# Altium schematic sheet PSFB_low_voltage_supply.SchDoc
size 420 x 297 mm
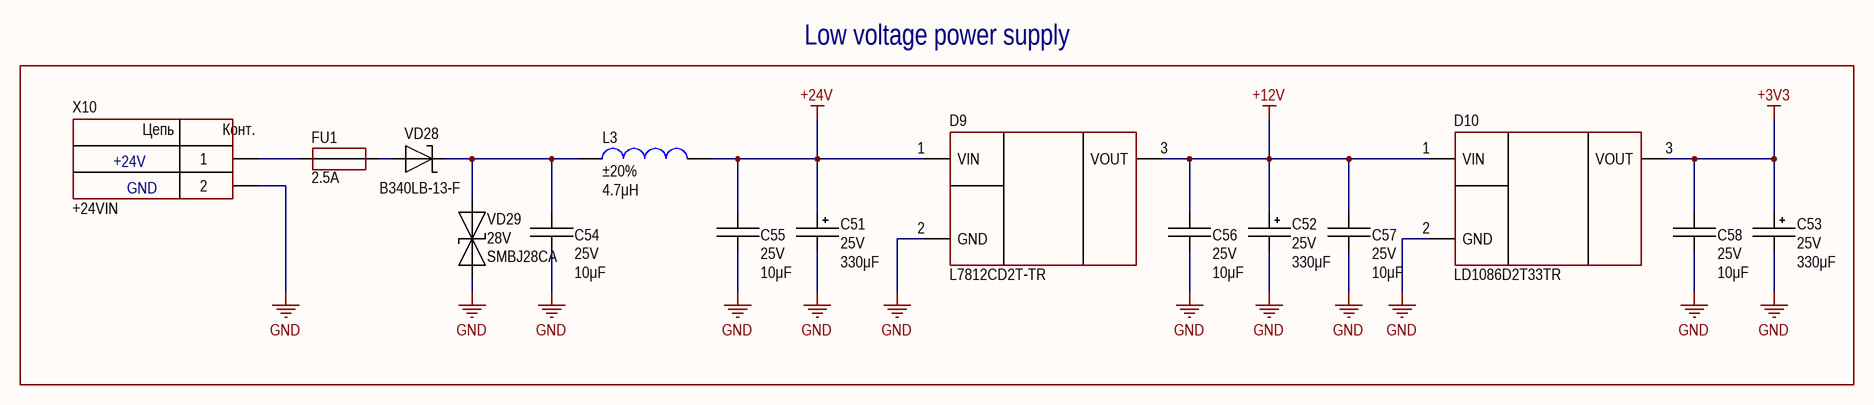
[diagram p0: PSFB_low_voltage_supply.SchDoc]

## Parts
C51  value 330μF  Voltage: 25V  [CAP: D8C3.5H12]
C52  value 330μF  Voltage: 25V  [CAP: D8C3.5H12]
C53  value 330μF  Voltage: 25V  [CAP: D8C3.5H12]
C54  value 10μF  Voltage: 25V  [CAP: 1206]
C55  value 10μF  Voltage: 25V  [CAP: 1206]
C56  value 10μF  Voltage: 25V  [CAP: 1206]
C57  value 10μF  Voltage: 25V  [CAP: 1206]
C58  value 10μF  Voltage: 25V  [CAP: 1206]
D9  PartNumber: L7812CD2T-TR  [D2PAK]
D10  PartNumber: LD1086D2T33TR  [D2PAK]
FU1  MaxCurrent: 2.5A  [FUSE: 1206]
L3  value 4.7μH  Tolerance: ±20%  [IND: SDR0403]
VD28  PartNumber: B340LB-13-F  [DIODE: SMB]
VD29  Voltage: 28V  PartNumber: SMBJ28CA  [DIODE: SMB]
X10  CommentText: +24VIN  [CON: 6PCV-02-006]

## Nets
+3V3: C53.1 C58.1 D10.3(VOUT)
+12V: C52.1 C56.1 C57.1 D9.3(VOUT) D10.1(VIN)
+24V: C51.1 C55.1 D9.1(VIN) L3.1
GND: C51.2 C52.2 C53.2 C54.2 C55.2 C56.2 C57.2 C58.2 D9.2(GND) D10.2(GND) VD29.2(C) X10.2
NetC54_1: C54.1 L3.2 VD28.2 VD29.1(A)
NetFU1_1: FU1.1 X10.1
NetFU1_2: FU1.2 VD28.1

## Notes on the sheet
- Low voltage power supply
- +24V
- GND
- Author
- Manufacturer
- Date
- Page
- Total pages
- Size page
- A3
- Materials
- (in symbol Connector_6PCV-02) Цепь; Конт.

## Library data of the parts
C51-C53 = Aluminium: 330µF 25V Aluminum - Polymer Capacitors Radial, Can 18mOhm 2000 Hrs @ 105°C; Manufacturer: KEMET; PartNumber: A750KS337M1EAAE018; ValueManufacturerPartNumber: Aluminium capacitor, 330μF, 25V, ±20%, 18mOhm, 13x8x3.5 mm, -55...+105°C; TypeCapacitor: Aluminium capacitor; Tolerance: ±20%; Package: 13x8x3.5 mm; HelpURL: https://www.digikey.com/en/products/detail/kemet/A750KS337M1EAAE018/6196447; Temperature: -55...+105°C; Impedance: 18mOhm
C54-C58 = Ceramic_1206: 10µF ±10% 25V Ceramic Capacitor X7R 1206 (3216 Metric); Manufacturer: Yageo; PartNumber: CC1206KKX7R8BB106; ValueManufacturerPartNumber: Ceramic capacitor, 10μF, X7R, ±10%, 25V, 1206, -55...+125°C; Package: 1206; HelpURL: https://www.digikey.com/en/products/detail/yageo/CC1206KKX7R8BB106/5195365; Temperature: -55...+125°C; TypeCapacitor: Ceramic capacitor; Tolerance: ±10%; TypeDielectric: X7R
D9 = L7805ABV: Linear Voltage Regulator IC Positive Fixed 1 Output  1.5A D2PAK; Manufacturer: STMicroelectronics; ValueManufacturerPartNumber: Linear voltage regulator, input 14...35V, 2V, output 12V, 1.5A, -40...+125°C, TO-220; VoltageInput: input 14...35V; MaxDropout: 2V; VoltageOutput: output 12V; HelpURL: https://www.digikey.com/en/products/detail/stmicroelectronics/L7812CD2T-TR/585702; Package: TO-220; ComponentType: Linear voltage regulator; Temperature: -40...+125°C; CurrentOutput: 1.5A
D10 = L7805ABV: Linear Voltage Regulator IC Positive Fixed 1 Output  1.5A D2PAK; Manufacturer: STMicroelectronics; ValueManufacturerPartNumber: Linear voltage regulator, input 4.8...30V, 2V, output 3.3V, 1.5A, -40...+125°C, TO-220; VoltageInput: input 4.8...30V; MaxDropout: 2V; VoltageOutput: output 3.3V; HelpURL: https://www.digikey.com/en/products/detail/stmicroelectronics/LD1086D2T33TR/585748; Package: TO-220; ComponentType: Linear voltage regulator; Temperature: -40...+125°C; CurrentOutput: 1.5A
FU1 = Fuse: 2.5A 125V AC 63V DC Fuse Board Mount (Cartridge Style Excluded) Surface Mount 1206 (3216 Metric); Manufacturer: Bel Fuse Inc.; PartNumber: C1Q 2.5; TypeFuse: Electromechanics relay; Package: 1206; HelpURL: https://www.digikey.com/en/products/detail/bel-fuse-inc/C1Q-2-5/615152; ValueManufacturerPartNumber: =TypeFuse+', '+VoltageMax+', '+MaxCurrent+', '+Package+', '+Temperature; VoltageMax: 63V
L3 = Inductor_SDR0403: 4.7µH Unshielded Wirewound Inductor 1.7A 94mOhm Max Nonstandard; Manufacturer: Bourns; PartNumber: SDR0403-4R7ML; ValueManufacturerPartNumber: Fixed inductor, 4.7μH, ±20%, SDR0403, 1.7A, -40...+125°C; TypeInductor: Fixed inductor; Package: SDR0403; HelpURL: https://www.digikey.com/product-detail/en/bourns-inc/SDR0403-4R7ML/SDR0403-4R7MLCT-ND/2127096; Temperature: -40...+125°C; MaxCurrent: 1.7A
VD28 = Schottky_single: Diode Schottky 40V 3A Surface Mount SMB; Manufacturer: Diodes Incorporated; ValueManufacturerPartNumber: Schottky diode, 40V, 3A, 0.45V, 100pF, SMB, -55...+150°C; TypeDiode: Schottky diode; VoltageDrop: 0.45V; RecoveryTime: 100pF; Package: SMB; HelpURL: https://www.digikey.com/en/products/detail/diodes-incorporated/B340LB-13-F/755461; Temperature: -55...+150°C; Voltage: 40V; Current: 3A
VD29 = TVS_single: 45.4V Clamp 13.3A Ipp Tvs Diode Surface Mount DO-214AA (SMBJ); Manufacturer: Diodes Incorporated; Current: 600W; Package: SMB; HelpURL: https://www.digikey.com/en/products/detail/littelfuse-inc/SMBJ28CA/286003; ValueManufacturerPartNumber: =TypeDiode+', '+Voltage+', '+Current+', '+VoltageDrop+', '+RecoveryTime+', '+Package+', '+Temperature; Temperature: -55...+150°C; TypeDiode: TVS diode
X10 = Connector_6PCV-02: 2 Circuit 0.375" (9.53mm) Barrier Block Connector, Screws; Manufacturer: TE Connectivity; ValueManufacturerPartNumber: Connector, 2pin, 9.53mm, 300VAC, 25A; PartNumber: 6PCV-02-006; VoltageMax: 300VAC; CurrentMax: 25A; Multichannel: 2pin; HelpURL: https://www.digikey.com/en/products/detail/te-connectivity-amp-connectors/6PCV-02-006/1277933; TypeConnector: Connector; Pitch: 9.53mm